# Altium schematic sheet Main.SchDoc: SheetTitle
size A
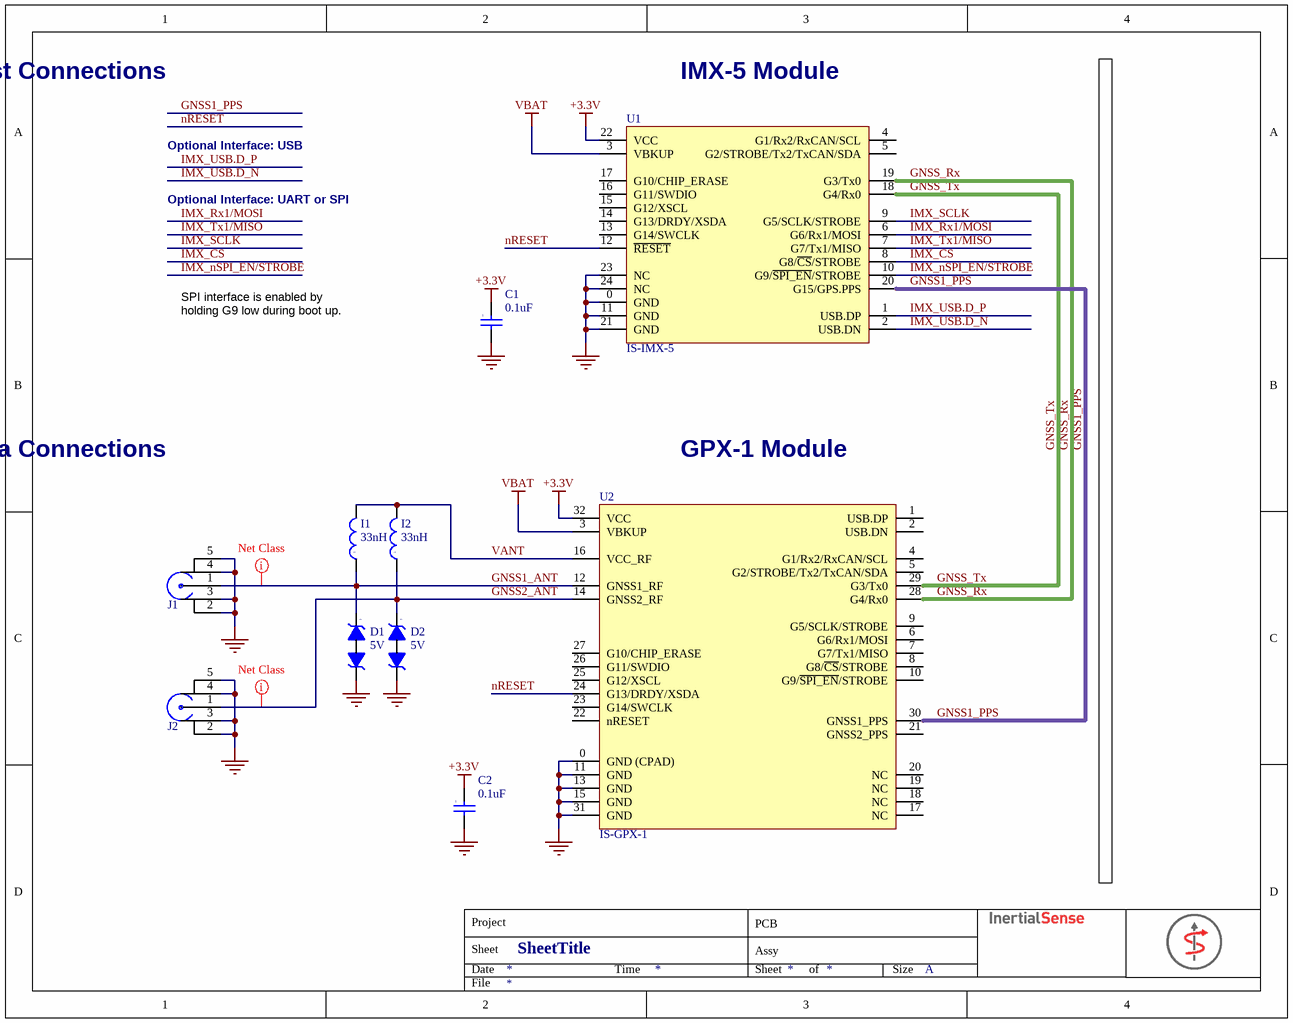
[diagram p0: Main.SchDoc]

## Parts
C1  value 0.1uF  [0402]  (hidden comment: Cap)
C2  value 0.1uF  [0402]  (hidden comment: Cap)
D1  Voltage - Reverse Standoff (Typ): 5V  [D0201]  (hidden comment: Diode - Bidirectional Zener)
D2  Voltage - Reverse Standoff (Typ): 5V  [D0201]  (hidden comment: Diode - Bidirectional Zener)
I1  value 33nH  [0201]  (hidden comment: Inductor)
I2  value 33nH  [0201]  (hidden comment: Inductor)
J1  RF - GND x 4  [RF SMA End Launch 2]  (value not drawn)
J2  RF - GND x 4  [RF SMA End Launch 2]  (value not drawn)
U1  Manufacturer Part Number: IS-IMX-5  [IS-IMX-5.0]  (hidden comment: IMX)
U2  Manufacturer Part Number: IS-GPX-1  [IS-GPX-1.0]  (hidden comment: GPX)

## Nets
+3.3V: C1.1 C2.1 U1.22(VCC) U2.32(VCC)
GND: C1.2 C2.2 D1.2 D2.2 J1.2 J1.3 J1.4 J1.5 J2.2 J2.3 J2.4 J2.5 U1.0(GND) U1.11(GND) U1.21(GND) U1.23(NC) U1.24(NC) U2.0(GND_(CPAD)) U2.11(GND) U2.13(GND) U2.15(GND) U2.31(GND)
VBAT: U1.3(VBKUP) U2.3(VBKUP)
GNSS1_ANT: D1.1 I1.1 J1.1 U2.12(GNSS1_RF)
GNSS1_PPS: U1.20(G15/GPS.PPS) U2.30(GNSS1_PPS)
GNSS2_ANT: D2.1 I2.1 J2.1 U2.14(GNSS2_RF)
GNSS_Rx: U1.19(G3/Tx0) U2.28(G4/Rx0)
GNSS_Tx: U1.18(G4/Rx0) U2.29(G3/Tx0)
IMX_~{CS}: U1.8(G8/~{CS}/STROBE)
IMX_nSPI_EN/STROBE: U1.10(G9/~{SPI_EN}/STROBE)
IMX_Rx1/MOSI: U1.6(G6/Rx1/MOSI)
IMX_SCLK: U1.9(G5/SCLK/STROBE)
IMX_Tx1/MISO: U1.7(G7/Tx1/MISO)
IMX_USB.D_N: U1.2(USB.DN)
IMX_USB.D_P: U1.1(USB.DP)
nRESET: U1.12(~{RESET}) U2.24(G13/DRDY/XSDA)
VANT: I1.2 I2.2 U2.16(VCC_RF)

Not connected (* = marked no-connect by the designer): U1 4(G1/Rx2/RxCAN/SCL) 5(G2/STROBE/Tx2/TxCAN/SDA) 13(G14/SWCLK) 14(G13/DRDY/XSDA) 15(G12/XSCL) 16(G11/SWDIO) 17(G10/CHIP_ERASE); U2 1(USB.DP) 2(USB.DN) 4(G1/Rx2/RxCAN/SCL) 5(G2/STROBE/Tx2/TxCAN/SDA) 6(G6/Rx1/MOSI) 7(G7/Tx1/MISO) 8(G8/~{CS}/STROBE) 9(G5/SCLK/STROBE) 10(G9/~{SPI_EN}/STROBE) 17(NC) 18(NC) 19(NC) 20(NC) 21(GNSS2_PPS) 22(nRESET) 23(G14/SWCLK) 25(G12/XSCL) 26(G11/SWDIO) 27(G10/CHIP_ERASE)

## Layout directives
net class RF_GPS: GNSS1_ANT, GNSS2_ANT

## Notes on the sheet
- Host Connections
- IMX-5 Module
- Optional Interface: USB
- Optional Interface: UART or SPI
- SPI interface is enabled by holding G9 low during boot up.
- Antenna Connections
- GPX-1 Module
- Date
- Sheet
- Project
- Time
- PCB
- Assy
- of
- Size
- A
- File

## Library data of the parts
C1 C2 = Cap: Capacitor; Published: 8-Jun-2000; LatestRevisionDate: 17-Jul-2002; LatestRevisionNote: Re-released for DXP Platform.; Publisher: Altium Limited; Category: Capacitors
D1 D2 = Diode - Bidirectional Zener: TVS DIODE 12VC 6A IPP 0201; Manufacturer: AVX Corporation; Manufacturer Part Number: GG020105100N2P; Bidirectional Channels: 1; Voltage - Breakdown (Min): 5.5V; Voltage - Clamping (Max) @ Ipp: 12V; Current - Peak Pulse (10/1000µs): 6A (8/20µs); Power - Peak Pulse: 60W; Power Line Protection: No; Capacitance @ Frequency: 10pF @ 1MHz; Supplier 1: Digi-Key; Supplier Part Number 1: 478-10590-2-ND; RoHS: RoHS Compliant; Category: Circuit Protection; Stock 1: 15000; Pricing 1: 15000=0.0482, 30000=0.04536, 75000=0.04253, 105000=0.0378 (USD); Packaging: Tape & Reel (TR); Type: Zener; Unidirectional Channels: -; Applications: General Purpose; Operating Temperature: -40°C ~ 125°C (TJ); Mounting Type: Surface Mount; Package / Case: 0201 (0603 Metric); Supplier Device Package: 0201; ComponentLink1URL: http://datasheets.avx.com/AVX-GiGuard.pdf; ComponentLink1Description: http://datasheets.avx.com/AVX-GiGuard.pdf
J1 J2 = RF - GND x 4: CONN SMA RCPT STR 50OHM EDGE MNT; Manufacturer: Molex; Manufacturer Part Number: 0732511150; Body Material: Brass; Body Plating: Gold; Dielectric Material: PTFE; Impedance: 50R; Connector Type: SMA,Socket; Max Frequency: 18GHz; Voltage Rating: 500V; Supplier 1: Digi-Key; Supplier Part Number 1: WM5534-ND; Stock 1: 22842; Pricing 1: 1=3.33, 10=3.193, 25=2.9272, 50=2.7942, 100=2.6612, 250=2.32856, 500=2.26202, 1600=1.86284, 3200=1.79631 (USD); Mount: Edge; Case/Package: SMA; Contact Plating: Gold; Contact Material: Copper; Insulation Material: Polytetrafluoroethylene; Housing Colour: Gold; Min Operating Temperature: -65°C; Max Operating Temperature: 165°C; Packaging: Tray; Termination: Solder; Package Quantity: 1600; Fastening Type: Threaded; Length: 9.53mm; Depth: 9.53mm; Radiation Hardening: No; Lead Free: Lead Free
U1 = IS-IMX-5.0: Inertial Sense IMX; Manufacturer: Inertial Sense; Supplier 1: Inertial Sense; Supplier Part Number 1: IS-IMX-5
U2 = IS-GPX-1.0: Inertial Sense GPX; Manufacturer: Inertial Sense; Supplier 1: Inertial Sense; Supplier Part Number 1: IS-GPX-1